# Altium schematic sheet i2c.SchDoc: I2C Devices
size A4; Organization: Berne University of Applied Science; Address1: School of Engineering and; Address2: Information Technology; Address3: Quellgasse 21; Address4: CH-2501 Biel; Revision: 1.0; SheetNumber: 15; SheetTotal: 19; ApprovedBy: zem1; Author: zac1
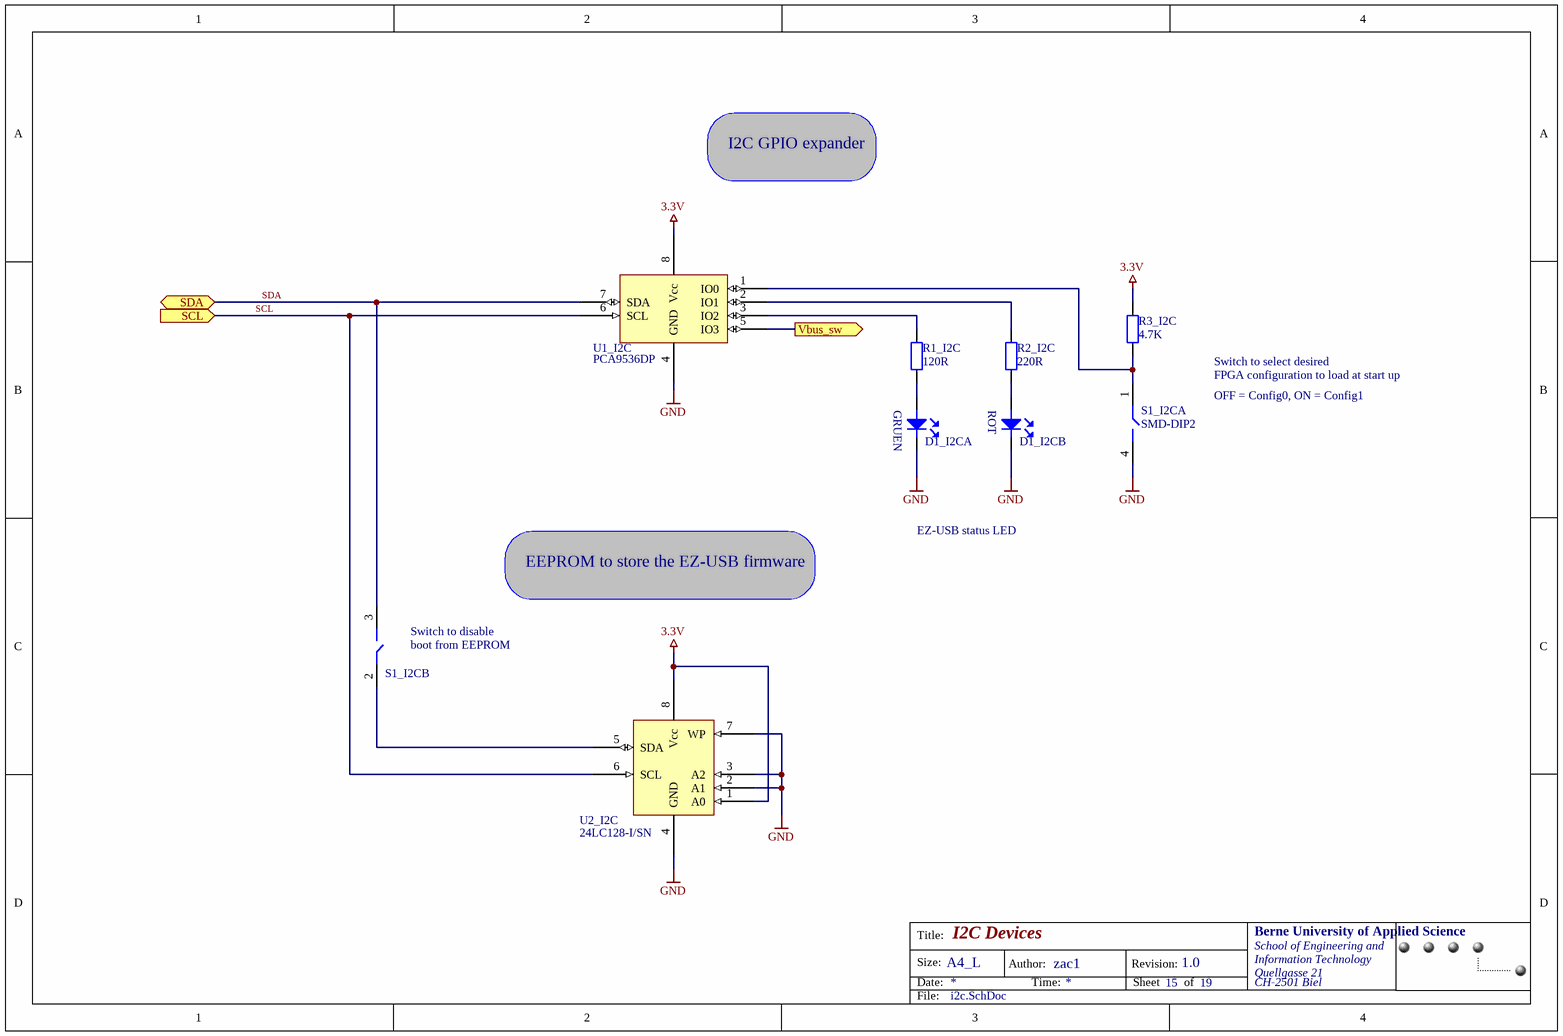
[diagram p0: i2c.SchDoc]

## Parts
D1_I2C  1211C-LED  [stan-led4]  (value not drawn)  (parts A,B of 2)
R1_I2C  value 120R  [0402]  (hidden comment: Res2)
R2_I2C  value 220R  [0402]  (hidden comment: Res2)
R3_I2C  value 4.7K  [0402]  (hidden comment: Res2)
S1_I2C  value SMD-DIP2  [MINIDIP2]  (hidden comment: SW-DIP2)  (parts A,B of 2)
U1_I2C  value PCA9536DP  [TSSO3X6-G8/X.3]  (hidden comment: PCA9536)
U2_I2C  24LC128-I/SN  [SO-G8]

## Ports
SCL (in), SDA (bidir), Vbus_sw (out)

## Nets
3.3V: R3_I2C.2 U1_I2C.8(Vcc) U2_I2C.1(A0) U2_I2C.8(Vcc)
GND: D1_I2C.2(K) D1_I2C.4(K) S1_I2C.4 U1_I2C.4(GND) U2_I2C.2(A1) U2_I2C.3(A2) U2_I2C.4(GND) U2_I2C.7(WP)
SCL: U1_I2C.6(SCL) U2_I2C.6(SCL) ; port SCL
SDA: S1_I2C.3 U1_I2C.7(SDA) ; port SDA
Vbus_sw: U1_I2C.5(IO3) ; port Vbus_sw
NetD1_I2C_1: D1_I2C.1(A) R2_I2C.1
NetD1_I2C_3: D1_I2C.3(A) R1_I2C.1
NetR1_I2C_2: R1_I2C.2 U1_I2C.3(IO2)
NetR2_I2C_2: R2_I2C.2 U1_I2C.2(IO1)
NetR3_I2C_1: R3_I2C.1 S1_I2C.1 U1_I2C.1(IO0)
NetS1_I2C_2: S1_I2C.2 U2_I2C.5(SDA)

## Notes on the sheet
- I2C GPIO expander
- Switch to select desired
- FPGA configuration to load at start up
- OFF = Config0, ON = Config1
- EEPROM to store the EZ-USB firmware
- EZ-USB status LED
- (near S1_I2C) Switch to disable
- (near S1_I2C) boot from EEPROM
- Title:
- Size:
- Date:
- A4_L
- Author:
- Time:
- Revision:
- Sheet
- of
- File:
- (in symbol 1211C-LED, part A) GRUEN
- (in symbol 1211C-LED, part B) ROT

## Library data of the parts
D1_I2C = 1211C-LED: Stanley 1211C Bi-Color Ultra Compact SMT LED; Value: BRBG1211C; Currency: CHF; Packaging unit: 1; Prize: 0.86; Distributor Number: 253183; Manufacturer: Stanley; Part Number: BRBG1211C; RoHS: yes; Distributor: Distrelec
R1_I2C = Res2: Resistor; Manufacturer: PHYCOMP; Part Number: 232270671201; Class I: Passive; Currency: CHF; Packaging unit: 50; Prize: 0.12; Published: 8-Jun-2000; Revision: July-2002: Re-released for DXP Platform.; Publisher: Altium Limited; Class II: Resistor; Distributor Number: 9239120; RoHS: yes; Distributor: Farnell
R2_I2C = Res2: Resistor; Manufacturer: PHYCOMP; Part Number: 232270672201; Class I: Passive; Currency: CHF; Packaging unit: 50; Prize: 0.12; Published: 8-Jun-2000; Revision: July-2002: Re-released for DXP Platform.; Publisher: Altium Limited; Class II: Resistor; Distributor Number: 9239154; RoHS: yes; Distributor: Farnell
R3_I2C = Res2: Resistor; Manufacturer: PHYCOMP; Part Number: 232270674702; Class I: Passive; Currency: CHF; Packaging unit: 50; Prize: 0.12; Published: 8-Jun-2000; Revision: July-2002: Re-released for DXP Platform.; Publisher: Altium Limited; Class II: Resistor; Distributor Number: 9239316; RoHS: yes; Distributor: Farnell
S1_I2C = SW-DIP2: Manufacturer: TYCO; Part Number: GDH02S; Currency: CHF; Packaging unit: 1; Prize: 7.1; Distributor Number: 1123952; RoHS: yes; Distributor: Farnell
U1_I2C = PCA9536: 4-bit I2C I/O Port; Manufacturer: TI; Part Number: PCA9536DGKR; Currency: CHF; Packaging unit: 1; Prize: 2.45; lead time: 2 Weeks; Distributor Number: 1310 217; RoHS: yes; Distributor: Farnell
U2_I2C = 24LC128-I/SN: Manufacturer: Microchip; Currency: CHF; lead time: 6 Weeks; Packaging unit: 100; Prize: 0.96; Value: 24LC128-I/SN; Distributor Number: 24LC128ISN; Part Number: 24LC128-I/SN; RoHS: yes; Distributor: Silica